# Altium project FOC_BOARD.PrjPcb
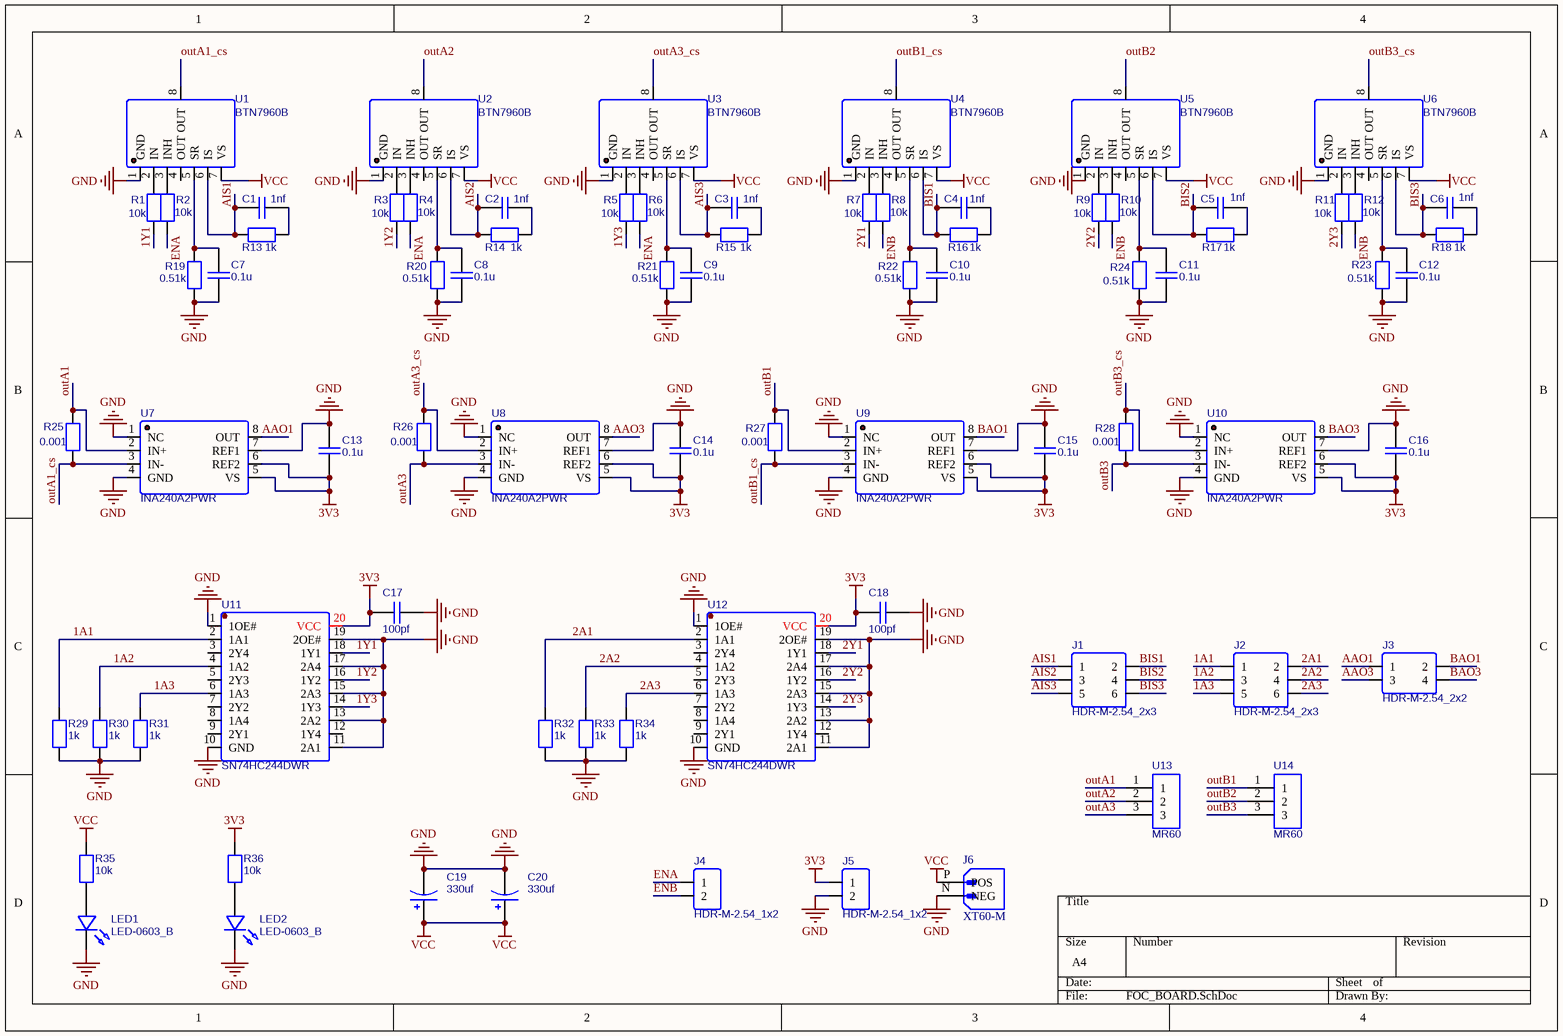
[diagram p0: FOC_BOARD.SchDoc]
1 sheet, 78 parts. Net scope: global (net labels, ports and power ports of the same name join across sheets).
Board file: FOC_BOARD.PcbDoc

## Sheet FOC_BOARD.SchDoc
size A4; SheetNumber: 1; SheetTotal: 1

### Parts
C1  1nf  [C0603]
C2  1nf  [C0603]
C3  1nf  [C0603]
C4  1nf  [C0603]
C5  1nf  [C0603]
C6  1nf  [C0603]
C7  0.1u  [C0603]
C8  0.1u  [C0603]
C9  0.1u  [C0603]
C10  0.1u  [C0603]
C11  0.1u  [C0603]
C12  0.1u  [C0603]
C13  0.1u  [C0603]
C14  0.1u  [C0603]
C15  0.1u  [C0603]
C16  0.1u  [C0603]
C17  100pf  [C0603]
C18  100pf  [C0603]
C19  330uf  [CAP-T-10*10.5]
C20  330uf  [CAP-T-10*10.5]
J1  HDR-M-2.54_2x3  [HDR-M-2.54_2X3]
J2  HDR-M-2.54_2x3  [HDR-M-2.54_2X3]
J3  HDR-M-2.54_2x2  [HDR-M-2.54_2X2]
J4  HDR-M-2.54_1x2  [HDR-M-2.54_1X2]
J5  HDR-M-2.54_1x2  [HDR-M-2.54_1X2]
J6  XT60-M  [AMASS_XT60-M]
LED1  LED-0603_B  [LED0603_BLUE]
LED2  LED-0603_B  [LED0603_BLUE]
R1  10k  [R0603]
R2  10k  [R0603]
R3  10k  [R0603]
R4  10k  [R0603]
R5  10k  [R0603]
R6  10k  [R0603]
R7  10k  [R0603]
R8  10k  [R0603]
R9  10k  [R0603]
R10  10k  [R0603]
R11  10k  [R0603]
R12  10k  [R0603]
R13  1k  [R0603]
R14  1k  [R0603]
R15  1k  [R0603]
R16  1k  [R0603]
R17  1k  [R0603]
R18  1k  [R0603]
R19  0.51k  [R0603]
R20  0.51k  [R0603]
R21  0.51k  [R0603]
R22  0.51k  [R0603]
R23  0.51k  [R0603]
R24  0.51k  [R0603]
R25  0.001  [R2512]
R26  0.001  [R2512]
R27  0.001  [R2512]
R28  0.001  [R2512]
R29  1k  [R0603]
R30  1k  [R0603]
R31  1k  [R0603]
R32  1k  [R0603]
R33  1k  [R0603]
R34  1k  [R0603]
R35  10k  [R0603]
R36  10k  [R0603]
U1  BTN7960B  [TO-263-7_L10.2-W10.4-P1.27-LS14.4-TL]
U2  BTN7960B  [TO-263-7_L10.2-W10.4-P1.27-LS14.4-TL]
U3  BTN7960B  [TO-263-7_L10.2-W10.4-P1.27-LS14.4-TL]
U4  BTN7960B  [TO-263-7_L10.2-W10.4-P1.27-LS14.4-TL]
U5  BTN7960B  [TO-263-7_L10.2-W10.4-P1.27-LS14.4-TL]
U6  BTN7960B  [TO-263-7_L10.2-W10.4-P1.27-LS14.4-TL]
U7  INA240A2PWR  [TSSOP-8_L4.4-W3.0-P0.65-LS6.4-BL]
U8  INA240A2PWR  [TSSOP-8_L4.4-W3.0-P0.65-LS6.4-BL]
U9  INA240A2PWR  [TSSOP-8_L4.4-W3.0-P0.65-LS6.4-BL]
U10  INA240A2PWR  [TSSOP-8_L4.4-W3.0-P0.65-LS6.4-BL]
U11  SN74HC244DWR  [SN74HC244DWR]
U12  SN74HC244DWR  [SN74HC244DWR]
U13  MR60  [MR60_F]
U14  MR60  [MR60_F]

### Nets
3V3: C13.1 C14.1 C15.1 C16.1 C17.1 C18.1 J5.1 R36.2 U7.5(VS) U7.6(REF2) U8.5(VS) U8.6(REF2) U9.5(VS) U9.6(REF2) U10.5(VS) U10.6(REF2) U11.20(VCC) U12.20(VCC)
GND: C7.1 C8.1 C9.1 C10.1 C11.1 C12.1 C13.2 C14.2 C15.2 C16.2 C17.2 C18.2 C19.2 C20.2 J5.2 J6.N(NEG) LED1.2 LED2.2 R19.1 R20.1 R21.1 R22.1 R23.1 R24.1 R29.2 R30.2 R31.2 R32.2 R33.2 R34.2 U1.1(GND) U2.1(GND) U3.1(GND) U4.1(GND) U5.1(GND) U6.1(GND) U7.1(NC) U7.4(GND) U7.7(REF1) U8.1(NC) U8.4(GND) U8.7(REF1) U9.1(NC) U9.4(GND) U9.7(REF1) U10.1(NC) U10.4(GND) U10.7(REF1) U11.1(1OE#) U11.10(GND) U11.11(2A1) U11.13(2A2) U11.15(2A3) U11.17(2A4) U11.19(2OE#) U12.1(1OE#) U12.10(GND) U12.11(2A1) U12.13(2A2) U12.15(2A3) U12.17(2A4) U12.19(2OE#)
VCC: C19.1 C20.1 J6.P(POS) R35.2 U1.7(VS) U2.7(VS) U3.7(VS) U4.7(VS) U5.7(VS) U6.7(VS)
1A1: J2.1 R29.1 U11.2(1A1)
1A2: J2.3 R30.1 U11.4(1A2)
1A3: J2.5 R31.1 U11.6(1A3)
1Y1: R1.2 U11.18(1Y1)
1Y2: R3.2 U11.16(1Y2)
1Y3: R5.2 U11.14(1Y3)
2A1: J2.2 R32.1 U12.2(1A1)
2A2: J2.4 R33.1 U12.4(1A2)
2A3: J2.6 R34.1 U12.6(1A3)
2Y1: R7.2 U12.18(1Y1)
2Y2: R9.2 U12.16(1Y2)
2Y3: R11.2 U12.14(1Y3)
AAO1: J3.1 U7.8(OUT)
AAO3: J3.3 U8.8(OUT)
AIS1: C1.1 J1.1 R13.1 U1.6(IS)
AIS2: C2.1 J1.3 R14.1 U2.6(IS)
AIS3: C3.1 J1.5 R15.1 U3.6(IS)
BAO1: J3.2 U9.8(OUT)
BAO3: J3.4 U10.8(OUT)
BIS1: C4.1 J1.2 R16.1 U4.6(IS)
BIS2: C5.1 J1.4 R17.1 U5.6(IS)
BIS3: C6.1 J1.6 R18.1 U6.6(IS)
ENA: J4.1 R2.1 R4.1 R6.1
ENB: J4.2 R8.1 R10.1 R12.1
outA1: R25.2 U7.2(IN+) U13.1
outA1_cs: R25.1 U1.8(OUT) U7.3(IN-)
outA2: U2.8(OUT) U13.2
outA3: R26.1 U8.3(IN-) U13.3
outA3_cs: R26.2 U3.8(OUT) U8.2(IN+)
outB1: R27.2 U9.2(IN+) U14.1
outB1_cs: R27.1 U4.8(OUT) U9.3(IN-)
outB2: U5.8(OUT) U14.2
outB3: R28.1 U10.3(IN-) U14.3
outB3_cs: R28.2 U6.8(OUT) U10.2(IN+)
NetC1_2: C1.2 R13.2
NetC2_2: C2.2 R14.2
NetC3_2: C3.2 R15.2
NetC4_2: C4.2 R16.2
NetC5_2: C5.2 R17.2
NetC6_2: C6.2 R18.2
NetC7_2: C7.2 R19.2 U1.5(SR)
NetC8_2: C8.2 R20.2 U2.5(SR)
NetC9_2: C9.2 R21.2 U3.5(SR)
NetC10_2: C10.2 R22.2 U4.5(SR)
NetC11_2: C11.2 R24.2 U5.5(SR)
NetC12_2: C12.2 R23.2 U6.5(SR)
NetLED1_1: LED1.1 R35.1
NetLED2_1: LED2.1 R36.1
NetR1_1: R1.1 U1.2(IN)
NetR2_2: R2.2 U1.3(INH)
NetR3_1: R3.1 U2.2(IN)
NetR4_2: R4.2 U2.3(INH)
NetR5_1: R5.1 U3.2(IN)
NetR6_2: R6.2 U3.3(INH)
NetR7_1: R7.1 U4.2(IN)
NetR8_2: R8.2 U4.3(INH)
NetR9_1: R9.1 U5.2(IN)
NetR10_2: R10.2 U5.3(INH)
NetR11_1: R11.1 U6.2(IN)
NetR12_2: R12.2 U6.3(INH)

Not connected (* = marked no-connect by the designer): U1 4(OUT); U2 4(OUT); U3 4(OUT); U4 4(OUT); U5 4(OUT); U6 4(OUT); U11 3(2Y4) 5(2Y3) 7(2Y2) 8(1A4) 9(2Y1) 12(1Y4); U12 3(2Y4) 5(2Y3) 7(2Y2) 8(1A4) 9(2Y1) 12(1Y4)

### Library data of the parts
C1-C6 = 1nf: nameAlias: Value(F); Contributor: LCEDA_Lib; Value: 1n; spicePre: C; spiceSymbolName: C_0603_US
C7-C16 = 0.1u: nameAlias: Value(F); Contributor: LCEDA_Lib; Value: 1n; spicePre: C; spiceSymbolName: C_0603_US
C17 C18 = 100pf: nameAlias: Value(F); Contributor: LCEDA_Lib; spicePre: C; spiceSymbolName: C_0603_US
C19 C20 = 330uf: nameAlias: Value(F); Contributor: LCEDA_Lib; Value: 1n; spicePre: C; spiceSymbolName: C_Tan_SMD_A_US
J1 J2 = HDR-M-2.54_2x3: Contributor: LCEDA_Lib; BOM_Supplier Part: C65114; BOM_Supplier: LCSC; spicePre: J; spiceSymbolName: HDR-M-2.54_2x3
J3 = HDR-M-2.54_2x2: Contributor: LCEDA_Lib; BOM_Supplier Part: C66690; BOM_Supplier: LCSC; spicePre: J; spiceSymbolName: HDR-M-2.54_2x2
J4 J5 = HDR-M-2.54_1x2: Contributor: LCEDA_Lib; BOM_Supplier Part: C124375; BOM_Supplier: LCSC; spicePre: J; spiceSymbolName: HDR-M-2.54_1x2
J6 = XT60-M: Plug; DC supply; XT60; male; PIN: 2; for cable; soldered; 30A; 500V; MF: AMASS; Package: Package; Availability: Not in stock; SnapEDA_Link: https://www.snapeda.com/parts/XT60-M/AMASS/view-part/?ref=snap; Check_prices: https://www.snapeda.com/parts/XT60-M/AMASS/view-part/?ref=eda; MP: XT60-M; Price: None; Value: *
LED1 LED2 = LED-0603_B: BOM_Manufacturer: EVERLIGHT(台湾亿光); BOM_Manufacturer Part: 19-217/BHC-ZL1M2RY/3T; Contributor: LCEDA_01; Value: 1u; BOM_Supplier Part: C72041; BOM_Supplier: LCSC; spicePre: L; spiceSymbolName: LED-0603_B
R1-R12 R35 R36 = 10k: nameAlias: Value(Ω); Contributor: LCEDA_Lib; Value: 1K; spicePre: R; spiceSymbolName: R_0603_EU
R13-R18 R29-R34 = 1k: nameAlias: Value(Ω); Contributor: LCEDA_Lib; spicePre: R; spiceSymbolName: R_0603_EU; Value: 1K
R19-R24 = 0.51k: nameAlias: Value(Ω); Contributor: LCEDA_Lib; Value: 1K; spicePre: R; spiceSymbolName: R_0603_EU
R25-R28 = 0.001: nameAlias: Value(Ω); Contributor: LCEDA_Lib; Value: 1K; spicePre: R; spiceSymbolName: R_0603_EU
U1-U6 = BTN7960B: BOM_Manufacturer: Infineon(英飞凌); Contributor: LCSC; BOM_Supplier: LCSC; BOM_Supplier Part: C648660; BOM_Manufacturer Part: BTN7960B; BOM_JLCPCB Part Class: Extended Part; spicePre: U; spiceSymbolName: BTN7960B
U7-U10 = INA240A2PWR: BOM_Manufacturer: TI; Contributor: LCSC; BOM_Supplier: LCSC; BOM_Manufacturer Part: INA240A2PWR; BOM_Supplier Part: C129949; BOM_JLCPCB Part Class: Extended Part; spicePre: U; spiceSymbolName: INA240A2PWR
U11 U12 = SN74HC244DWR: BOM_Manufacturer: TI; BOM_Manufacturer Part: SN74AHC244DWR; SMT Type: Extend; spicePre: X; BOM_Supplier: LCSC; image: //image.lceda.cn/szlcsc/C7473.jpg; BOM_Supplier Part: C7473; BOM_LCSC Assembly: Yes; spiceSymbolName: SN74AHC244DWR
U13 U14 = MR60: Contributor: zjsxzc217; spicePre: U; spiceSymbolName: MR60